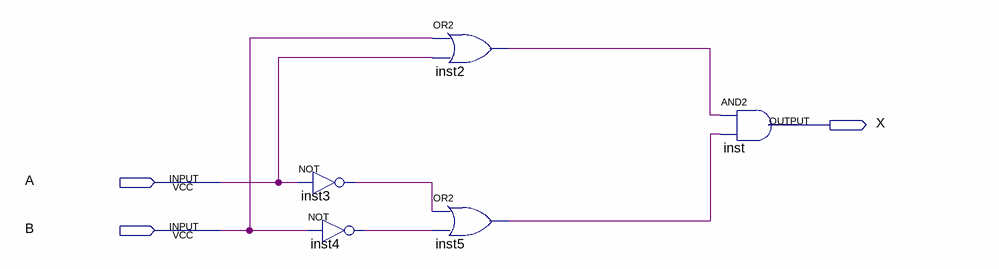
[diagram p0: schematic sheet]
// Quartus schematic LetraF.bdf as structural Verilog: 5 symbols, 3 pins
module LetraF (
  input  A,
  input  B,
  output X
);

  wire inst2_out, inst3_out, inst4_out, inst5_out;

  not inst3 (inst3_out, A);
  not inst4 (inst4_out, B);
  or inst2 (inst2_out, B, A);
  or inst5 (inst5_out, inst3_out, inst4_out);
  and inst (X, inst2_out, inst5_out);
endmodule
